# EAGLE design easyMini (EAGLE 9.6.2)
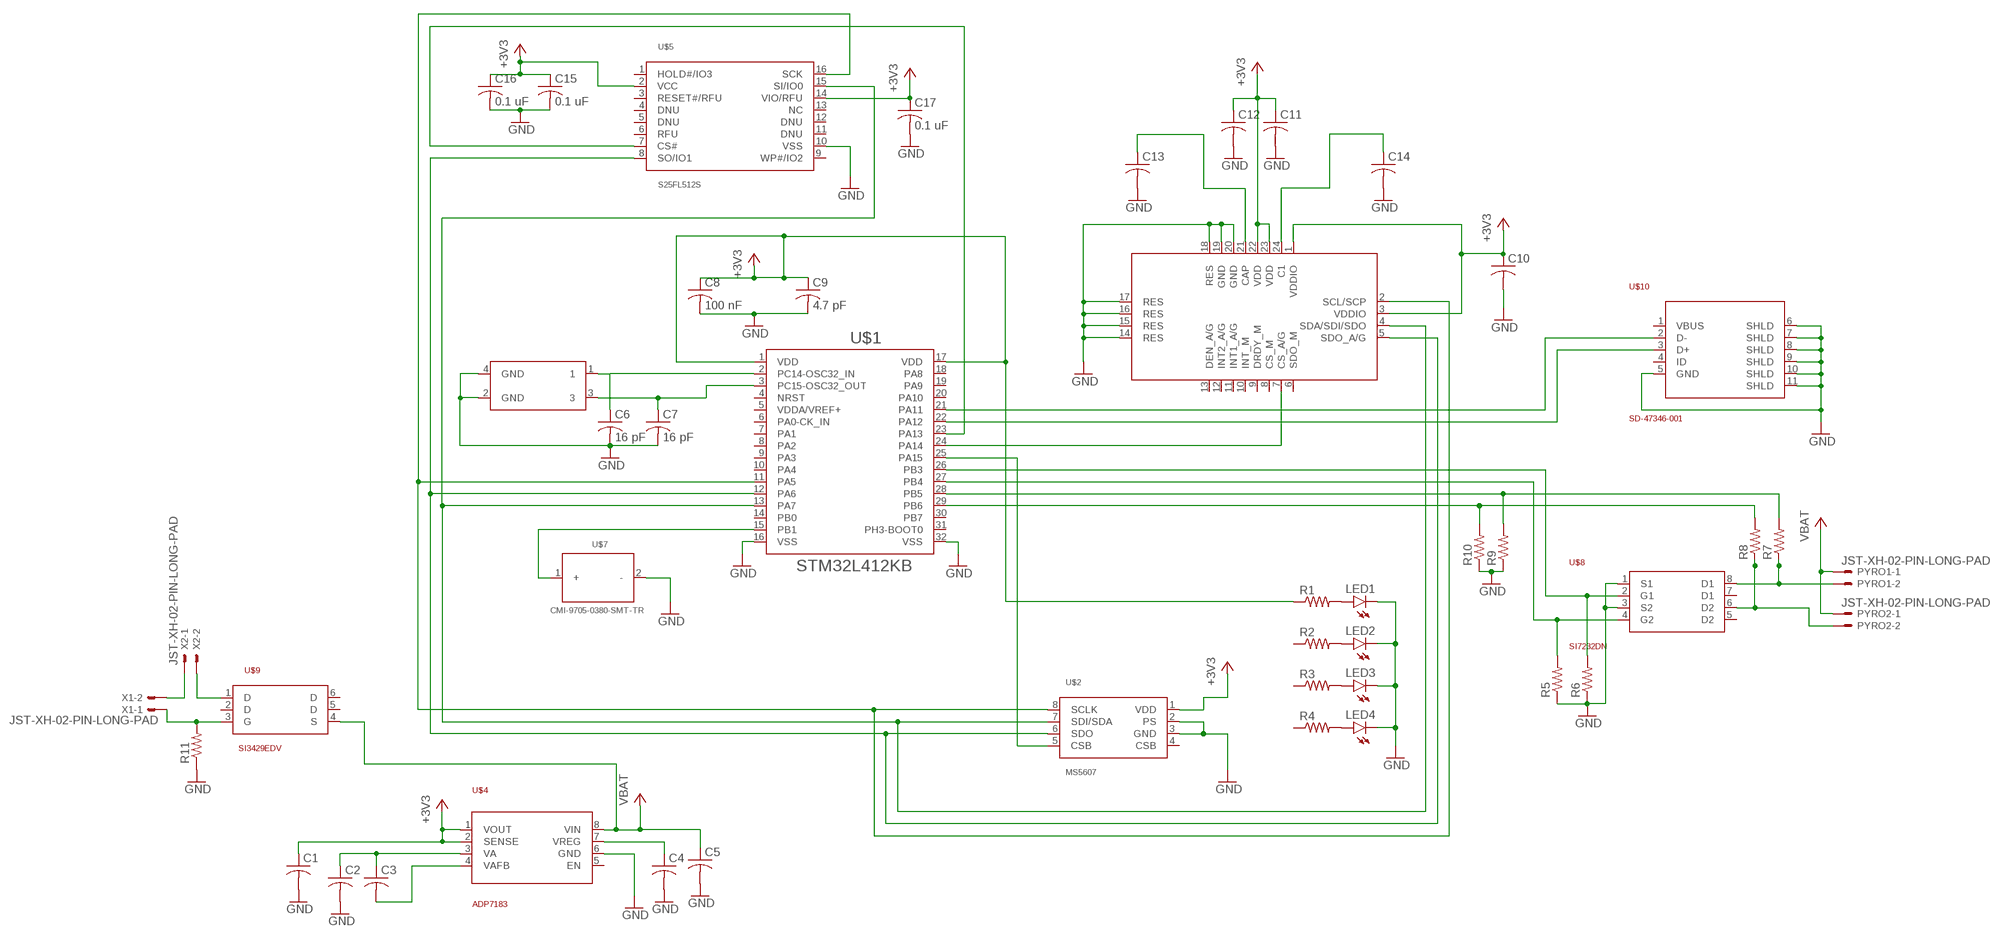
[diagram p0: schematic, sheet 1]

## Parts
C1  C-USC0805  [C0805]
C2  C-USC0805  [C0805]
C3  C-USC0805  [C0805]
C4  C-USC0805  [C0805]
C5  C-USC0805  [C0805]
C6  16 pF  C-USC0805  [C0805]
C7  16 pF  C-USC0805  [C0805]
C8  100 nF  C-USC0805  [C0805]
C9  4.7 pF  C-USC0805  [C0805]
C10  C-USC0805  [C0805]
C11  C-USC0805  [C0805]
C12  C-USC0805  [C0805]
C13  C-USC0805  [C0805]
C14  C-USC0805  [C0805]
C15  0.1 uF  C-USC0805  [C0805]
C16  0.1 uF  C-USC0805  [C0805]
C17  0.1 uF  C-USC0805  [C0805]
LED1  LED  [SMARTLED-TTW]
LED2  LED  [SMARTLED-TTW]
LED3  LED  [SMARTLED-TTW]
LED4  LED  [SMARTLED-TTW]
PYRO1  JST-XH-02-PIN-LONG-PAD  [JST-XH-02-PACKAGE-LONG-PAD]
PYRO2  JST-XH-02-PIN-LONG-PAD  [JST-XH-02-PACKAGE-LONG-PAD]
R1  R-US_M0805  [M0805]
R2  R-US_M0805  [M0805]
R3  R-US_M0805  [M0805]
R4  R-US_M0805  [M0805]
R5  R-US_M0805  [M0805]
R6  R-US_M0805  [M0805]
R7  R-US_M0805  [M0805]
R8  R-US_M0805  [M0805]
R9  R-US_M0805  [M0805]
R10  R-US_M0805  [M0805]
R11  R-US_M0805  [M0805]
U$1  STM32L412KB  [LQFP32]
U$2  MS5607  [MS5607]
U$3  LSM9DS1  [LSM9DS1]
U$4  ADP7183  [ADP7183]
U$5  S25FL512S  [S25FL512S]
U$6  SXT1148FE48-24.000MT  [SXT114]
U$7  CMI-9705-0380-SMT-TR  [CMI-9705-0380-SMT-TR]
U$8  SI7232DN  [SI7232DN]
U$9  SI3429EDV  [SI3429EDV]
U$10  SD-47346-001  [SD-47346-001]
X1  JST-XH-02-PIN-LONG-PAD  [JST-XH-02-PACKAGE-LONG-PAD]
X2  JST-XH-02-PIN-LONG-PAD  [JST-XH-02-PACKAGE-LONG-PAD]

## Nets
+3V3: C1.1 C8.1 C9.1 C10.1 C11.1 C12.1 C15.1 C16.1 C17.1 PYRO1.1 PYRO2.1 R1.1 U$1.1(VDD) U$1.17(VDD) U$2.1(VDD) U$3.1(VDDIO) U$3.3(VDDIO) U$3.22(VDD) U$3.23(VDD) U$4.1(VOUT) U$4.2(SENSE) U$5.2(VCC) U$5.14(VIO/RFU) ; supply symbol labelled VBAT
GND: C1.2 C2.2 C4.2 C5.2 C6.2 C7.2 C8.2 C9.2 C10.2 C11.2 C12.2 C13.2 C14.2 C15.2 C16.2 C17.2 LED1.C@1(C) LED2.C@1(C) LED3.C@1(C) LED4.C@1(C) R5.1 R6.1 R9.1 R10.1 R11.1 U$1.16(VSS) U$1.32(VSS) U$2.2(PS) U$2.3(GND) U$3.14(RES) U$3.15(RES) U$3.16(RES) U$3.17(RES) U$3.18(RES) U$3.19(GND) U$3.20(GND) U$4.6(GND) U$5.10(VSS) U$6.2(GND) U$6.4(GND) U$7.2(-) U$8.1(S1) U$8.3(S2) U$10.5(GND) U$10.6(SHLD) U$10.7(SHLD) U$10.8(SHLD) U$10.9(SHLD) U$10.10(SHLD) U$10.11(SHLD)
N$1: U$1.13(PA7) U$2.7(SDI/SDA) U$3.4(SDA/SDI/SDO) U$5.15(SI/IO0)
N$2: U$1.11(PA5) U$2.8(SCLK) U$3.2(SCL/SCP) U$5.16(SCK)
N$3: U$1.12(PA6) U$2.6(SDO) U$3.5(SDO_A/G) U$5.8(SO/IO1)
N$4: C13.1 U$3.21(CAP)
N$5: C14.1 U$3.24(C1)
N$6: C2.1 C3.1 U$4.3(VA)
N$7: C4.1 U$4.7(VREG)
N$8: C3.2 U$4.4(VAFB)
N$9: U$1.23(PA13) U$5.7(CS#)
N$10: LED1.A@1(A) R1.2
N$11: LED2.A@1(A) R2.2
N$12: LED3.A@1(A) R3.2
N$13: LED4.A@1(A) R4.2
N$14: PYRO1.2 R7.1 U$8.8(D1)
N$15: U$1.24(PA14) U$3.7(CS_A/G)
N$16: U$1.25(PA15) U$2.5(CSB)
N$17: PYRO2.2 R8.1 U$8.6(D2)
N$18: R6.2 U$1.26(PB3) U$8.2(G1)
N$19: R5.2 U$1.27(PB4) U$8.4(G2)
N$20: U$1.15(PB1) U$7.1(+)
N$21: R7.2 R9.2 U$1.28(PB5)
N$22: R8.2 R10.2 U$1.29(PB6)
N$23: X1.2 X2.1
N$24: C6.1 U$1.2(PC14-OSC32_IN) U$6.1
N$25: C7.1 U$1.3(PC15-OSC32_OUT) U$6.3
N$26: R11.2 U$9.3(G) X1.1
N$27: U$9.1(D) X2.2
N$28: U$1.21(PA11) U$10.2(D-)
N$29: U$1.22(PA12) U$10.3(D+)
VCC: C5.1 U$4.8(VIN) U$9.4(S) ; supply symbol labelled VBAT
Unconnected: R2.1 R3.1 R4.1 U$1.4(NRST) U$1.5(VDDA/VREF+) U$1.6(PA0-CK_IN) U$1.7(PA1) U$1.8(PA2) U$1.9(PA3) U$1.10(PA4) U$1.14(PB0) U$1.18(PA8) U$1.19(PA9) U$1.20(PA10) U$1.30(PB7) U$1.31(PH3-BOOT0) U$2.4(CSB) U$3.6(SDO_M) U$3.8(CS_M) U$3.9(DRDY_M) U$3.10(INT_M) U$3.11(INT1_A/G) U$3.12(INT2_A/G) U$3.13(DEN_A/G) U$4.5(EN) U$5.1(HOLD#/IO3) U$5.3(RESET#/RFU) U$5.4(DNU) U$5.5(DNU) U$5.6(RFU) U$5.9(WP#/IO2) U$5.11(DNU) U$5.12(DNU) U$5.13(NC) U$8.5(D2) U$8.7(D1) U$9.2(D) U$9.5(D) U$9.6(D) U$10.1(VBUS) U$10.4(ID)

## Library data of the parts
C1-C17 = rcl:C-US: CAPACITOR, American symbol; SPICEPREFIX: C
LED1-LED4 = led:LED: LED OSRAM: - CHIPLED LG R971, LG N971, LY N971, LG Q971, LY Q971, LO R971, LY R971 LH N974, LH R974 LS Q976, LO Q976, LY Q976 LO Q996 - Hyper CHIPLED LW Q18S LB Q993, LB Q99A, LB R99A - SideLED LS A670, LO A670, LY A670, LG A670, LP A670 LB A673, LV A673, LT A673, LW A673 LH A674 LY A675 LS A676, LA A676, LO A676, LY A676, LW A676 LS A679, LY A679, LG A679 - Hyper Micro SIDELED® LS Y876, LA Y876, LO Y876, LY Y876 LT Y87S - SmartLED LW L88C, LW L88S LB L89C, LB L89S, LG L890 LS L89K, LO L89K, LY L89K LS L896, LA L896, LO L896, LY L896 - TOPLED LS T670, LO T670, LY T670, LG T670, LP T670 LSG T670, LSP T670, LSY T670, LOP T670, LYG T670 LG T671, LOG T671, LSG T671 LB T673, LV T673, LT T673, LW T673 LH T674 LS T676, LA T676, LO T676, LY T676, LB T676, LH T676, LSB T676, LW T676 LB T67C, LV T67C, LT T67C, LS T67K, LO T67K, LY T67K, LW E67C LS E67B, LA E67B, LO E67B, LY E67B, LB E67C, LV E67C, LT E67C LW T67C LS T679, LY T679, LG T679 LS T770, LO T770, LY T770, LG T770, LP T770 LB T773, LV T773, LT T773, LW T773 LH T774 LS E675, LA E675, LY E675, LS T675 LS T776, LA T776, LO T776, LY T776, LB T776 LHGB T686 LT T68C, LB T68C - Hyper Mini TOPLED® LB M676 - Mini TOPLED Santana® LG M470 LS M47K, LO M47K, LY M47K Source: http://www.osram.convergy.de LUXEON: - LUMILED® LXK2-PW12-R00, LXK2-PW12-S00, LXK2-PW14-U00, LXK2-PW14-V00 LXK2-PM12-R00, LXK2-PM12-S00, LXK2-PM14-U00 LXK2-PE12-Q00, LXK2-PE12-R00, LXK2-PE12-S00, LXK2-PE14-T00, LXK2-PE14-U00 LXK2-PB12-K00, LXK2-PB12-L00, LXK2-PB12-M00, LXK2-PB14-N00, LXK2-PB14-P00, LXK2-PB14-Q00 LXK2-PR12-L00, LXK2-PR12-M00, LXK2-PR14-Q00, LXK2-PR14-R00 LXK2-PD12-Q00, LXK2-PD12-R00, LXK2-PD12-S00 LXK2-PH12-R00, LXK2-PH12-S00 LXK2-PL12-P00, LXK2-PL12-Q00, LXK2-PL12-R00 Source: www.luxeon.com KINGBRIGHT: KA-3528ASYC Source: www.kingbright.com
PYRO1 PYRO2 X1 X2 = Rembrandt Electronics - JST XH Connectors v1-0:JST-XH-02-PIN: JST XH Connector 2 Pin Wire to board connector. Pitch: 2,54 mm, (0.100") Number of pins: 2 Created by Rembrandt Electronics www.rembrandtelectronics.com
R1-R11 = rcl:R-US_: RESISTOR, American symbol; SPICEPREFIX: R
U$1 = stm32lib:STM32L412KB
U$2 = generalUse:MS5607
U$3 = generalUse:LSM9DS1
U$4 = generalUse:ADP7183
U$5 = generalUse:S25FL512S
U$6 = generalUse:SXT1148FE48-24.000MT
U$7 = generalUse:CMI-9705-0380-SMT-TR
U$8 = generalUse:SI7232DN
U$9 = generalUse:SI3429EDV
U$10 = generalUse:SD-47346-001

## Board
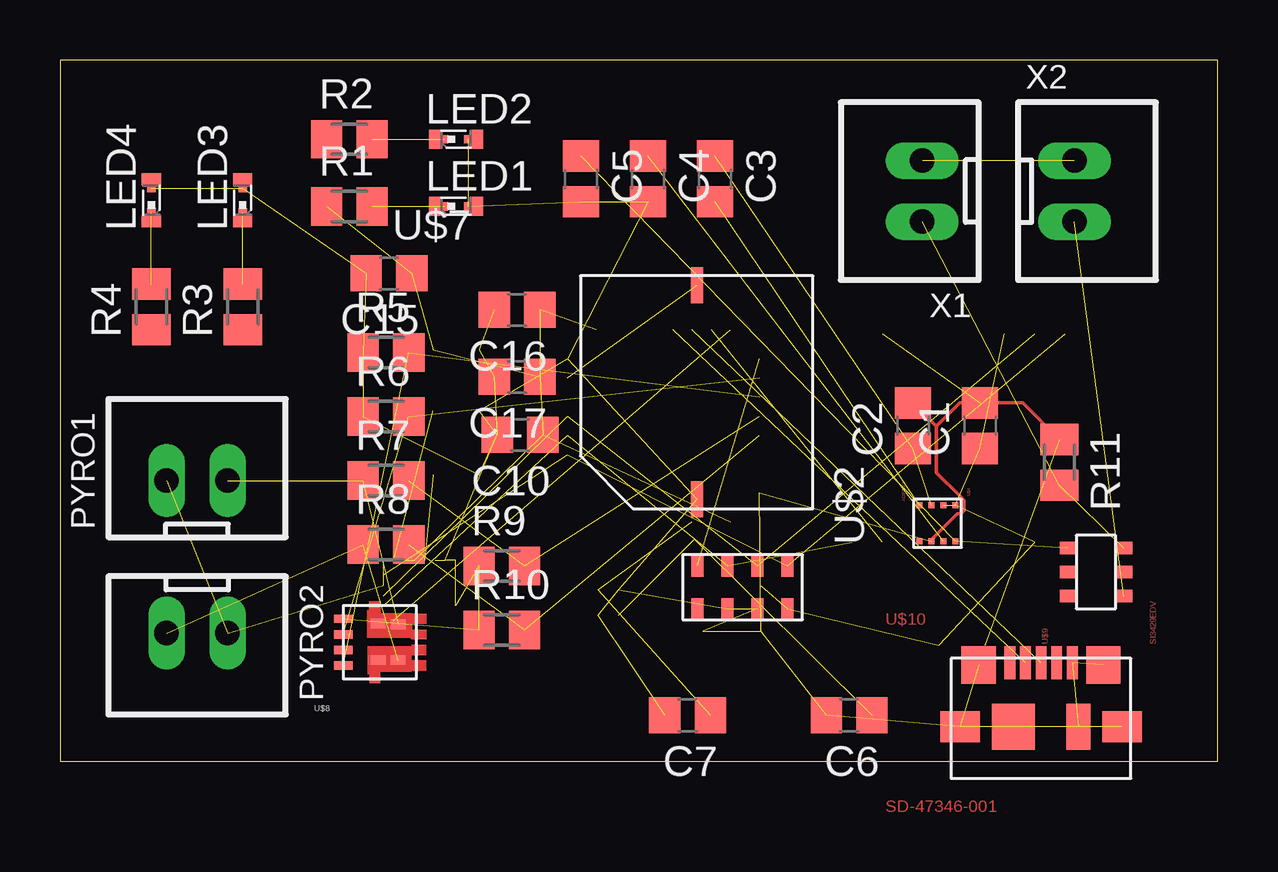
[diagram p1: board, top side]
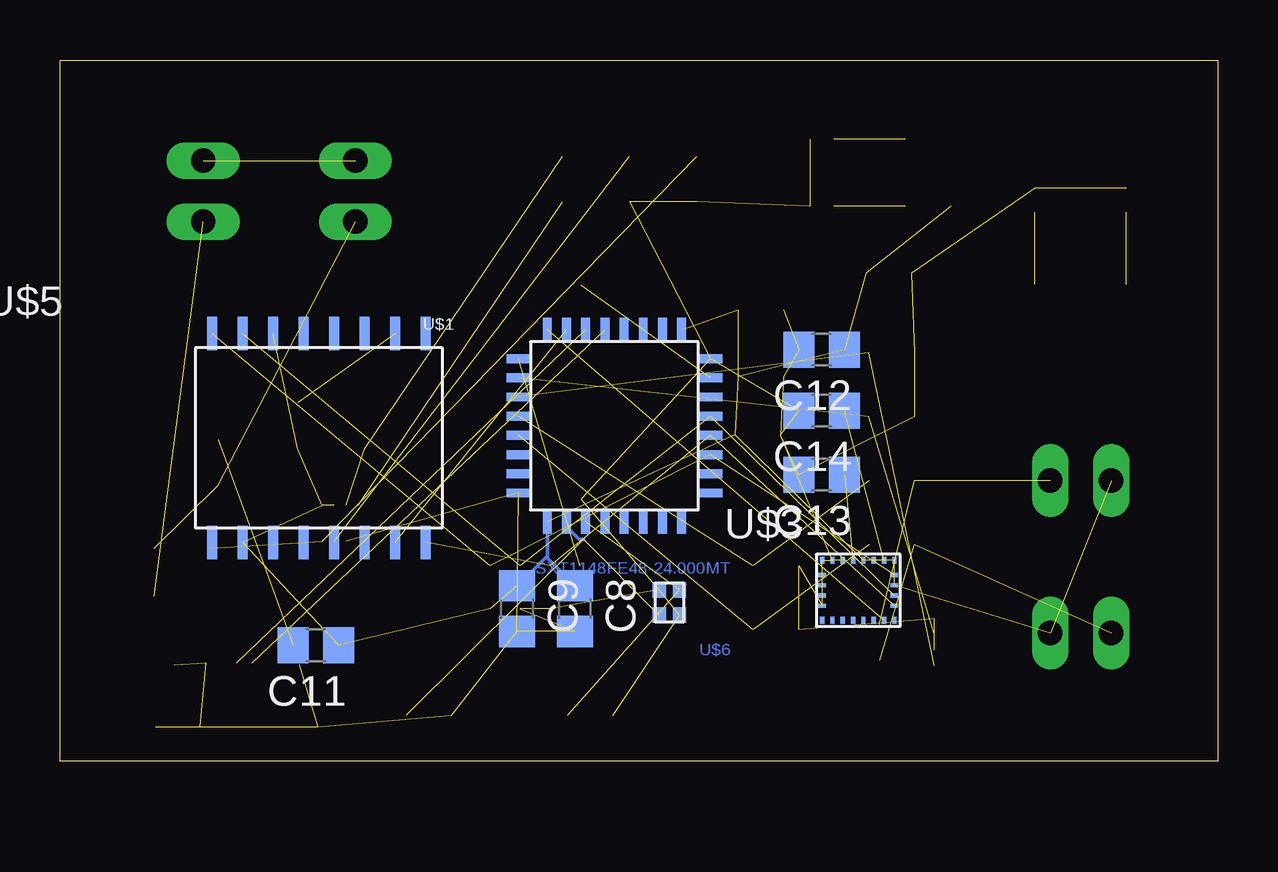
[diagram p2: board, bottom side, seen from below]

Size 48.26 x 29.21 mm. Coordinates in mm from the lower left corner, seen from the top.
Outline: 0,0 48.26,0 48.26,29.21 0,29.21 0,0
Copper layers (1*16): Top 0.035mm / dielectric 1.5mm / Bottom 0.035mm
Design rules "default": minimum track width 6mil, minimum drill 0.35mm, track to track 6mil, track to pad 6mil, pad to pad 6mil, via to via 6mil, smd to smd 6mil, copper to edge 40mil, drill to drill 6mil, minimum pad ring 10mil, minimum via ring 8mil, stop-mask expansion 4mil, vias tented up to drill 0mil, thermal gap 10mil

### Footprints (pad centres in the part's own frame; a part is rotated, then mirrored left to right if it is on the bottom)
C0805 = smd 1.3 x 1.5: 1 -0.95,0; 2 0.95,0
SMARTLED-TTW = smd 0.8 x 0.5: A 0,-0.875; C 0,0.875 | smd 0.35 x 0.35: A@1 0,-0.5; C@1 0,0.5
JST-XH-02-PACKAGE-LONG-PAD = drill 1.016 long: 1 -1.27,0; 2 1.27,0
M0805 = smd 1.3 x 1.6: 1 -0.95,0; 2 0.95,0
LQFP32 = smd 0.37 x 1: 1 -2.8,-4; 2 -2,-4; 3 -1.2,-4; 4 -0.4,-4; 5 0.4,-4; 6 1.2,-4; 7 2,-4; 8 2.8,-4; 17 2.8,4; 18 2,4; 19 1.2,4; 20 0.4,4; 21 -0.4,4; 22 -1.2,4; 23 -2,4; 24 -2.8,4 | smd 1 x 0.37: 9 4,-2.8; 10 4,-2; 11 4,-1.2; 12 4,-0.4; 13 4,0.4; 14 4,1.2; 15 4,2; 16 4,2.8; 25 -4,2.8; 26 -4,2; 27 -4,1.2; 28 -4,0.4; 29 -4,-0.4; 30 -4,-1.2; 31 -4,-2; 32 -4,-2.8
MS5607 = smd 0.9 x 0.5: 1 0.9,1.875; 2 0.9,0.625; 3 0.9,-0.625; 4 0.9,-1.875; 5 -0.9,-1.875; 6 -0.9,-0.625; 7 -0.9,0.625; 8 -0.9,1.875
LSM9DS1 = smd 0.18 x 0.3: 1 1.505,1.25; 6 1.505,-1.25; 7 1.075,-1.25; 8 0.645,-1.25; 9 0.215,-1.25; 10 -0.215,-1.25; 11 -0.645,-1.25; 12 -1.075,-1.25; 13 -1.505,-1.25; 18 -1.505,1.25; 19 -1.075,1.25; 20 -0.645,1.25; 21 -0.215,1.25; 22 0.215,1.25; 23 0.645,1.25; 24 1.075,1.25 | smd 0.3 x 0.18: 2 1.5,0.645; 3 1.5,0.215; 4 1.5,-0.215; 5 1.5,-0.645; 14 -1.5,-0.645; 15 -1.5,-0.215; 16 -1.5,0.215; 17 -1.5,0.645
ADP7183 = smd 0.25 x 0.25: 1 -0.75,0.75; 2 -0.75,0.25; 3 -0.75,-0.25; 4 -0.75,-0.75; 5 0.75,-0.75; 6 0.75,-0.25; 7 0.75,0.25; 8 0.75,0.75
S25FL512S = smd 0.41 x 1.4: 1 -4.445,-4.35; 2 -3.175,-4.35; 3 -1.905,-4.35; 4 -0.635,-4.35; 5 0.635,-4.35; 6 1.905,-4.35; 7 3.175,-4.35; 8 4.445,-4.35; 9 4.445,4.35; 10 3.175,4.35; 11 1.905,4.35; 12 0.635,4.35; 13 -0.635,4.35; 14 -1.905,4.35; 15 -3.175,4.35; 16 -4.445,4.35
SXT114 = smd 0.55 x 0.65: 1 0.425,0.525; 2 0.425,-0.525; 3 -0.425,-0.525; 4 -0.425,0.525
CMI-9705-0380-SMT-TR = smd 0.5 x 1.5: 1 0,4.45; 2 0,-4.45
SI7232DN = smd 0.76 x 0.35: 1 -1.525,0.975; 2 -1.525,0.325; 3 -1.525,-0.325; 4 -1.525,-0.975 | smd 0.6 x 0.4: 5 -0.061,-0.746; 6 0.752,-0.746; 7 -0.086,0.772; 8 0.777,0.746
SI3429EDV = smd 0.508 x 0.699: 1 -1.001,-1.162; 2 0,-1.162; 3 1.001,-1.162; 4 1.001,1.163; 5 0,1.163; 6 -1.001,1.163
SD-47346-001 = smd 0.45 x 1.38: 1 -1.3,2.31; 2 -0.65,2.31; 3 0,2.31; 4 0.65,2.31; 5 1.3,2.31 | smd 1.425 x 1.55: 6 -2.6,2.225; 11 2.6,2.225 | smd 1.65 x 1.3: 7 -3.375,-0.35; 10 3.375,-0.35 | smd 1.8 x 1.9: 8 -1.15,-0.35 | smd 1 x 1.9: 9 1.55,-0.35

### Placement (x,y rotation side)
C1  38.35,13.97 90 top
C2  35.56,13.97 90 top
C3  27.3,24.26 270 top
C4  24.51,24.26 270 top
C5  21.72,24.26 270 top
C6  32.89,1.91 180 top
C7  26.16,1.91 180 top
C8  26.8,6.35 270 bottom
C9  29.21,6.35 270 bottom
C10  19.18,13.59 180 top
C11  37.59,4.83 180 bottom
C12  16.51,17.14 180 bottom
C13  16.51,11.94 180 bottom
C14  16.51,14.61 180 bottom
C15  13.72,20.32 180 top
C16  19.05,18.8 180 top
C17  19.05,16 180 top
LED1  16.51,23.11 270 top
LED2  16.51,25.91 270 top
LED3  7.62,23.37 0 top
LED4  3.81,23.37 0 top
PYRO1  5.71,11.68 0 top
PYRO2  5.71,5.33 180 top
R1  12.06,23.11 0 top
R2  12.06,25.91 0 top
R3  7.62,18.92 90 top
R4  3.81,18.92 90 top
R5  13.59,17.02 0 top
R6  13.59,14.35 0 top
R7  13.59,11.68 0 top
R8  13.59,9.02 0 top
R9  18.41,8.13 0 top
R10  18.41,5.46 0 top
R11  41.66,12.45 270 top
U$1  25.15,13.97 0 bottom
U$2  28.45,7.24 270 top
U$3  14.99,7.11 0 bottom
U$4  36.58,9.91 270 top
U$5  37.47,13.46 0 bottom
U$6  22.86,6.6 180 bottom
U$7  26.54,15.37 0 top
U$8  13.34,4.95 0 top
U$9  43.18,7.87 90 top
U$10  40.89,1.78 0 top
X1  35.94,23.75 90 top
X2  42.29,23.75 270 top

### Tracks (layer width: path | path; a pad name or v marks a point on that pad's centre or on a via)
+3V3  (20 unrouted)
  Bottom 0.152: C9.1 27.95,8.56 | 27.95,8.56 U$1.1 | C8.1 27.95,8.45 27.95,8.56
GND  (46 unrouted)
  Top 0.152: R11.1 40.13,14.92 C1.2 37.52,14.92 36.54,13.94 | U$4.6 36.33,9.23 37.4,10.3 37.55,10.3 37.68,10.44 37.68,10.88 37.55,11.01 37.54,11.01 36.54,12.01 36.54,13.94 | 36.54,13.94 C2.2
N$1  (3 unrouted)
N$2  (3 unrouted)
N$3  (3 unrouted)
N$4  (1 unrouted)
N$5  (1 unrouted)
N$6  (2 unrouted)
N$7  (1 unrouted)
N$8  (1 unrouted)
N$9  (1 unrouted)
N$10  (1 unrouted)
N$11  (1 unrouted)
N$12  (1 unrouted)
N$13  (1 unrouted)
N$14  (2 unrouted)
N$15  (1 unrouted)
N$16  (1 unrouted)
N$17  (2 unrouted)
N$18  (2 unrouted)
N$19  (2 unrouted)
N$20  (1 unrouted)
N$21  (2 unrouted)
N$22  (2 unrouted)
N$23  (1 unrouted)
N$24  (2 unrouted)
  Bottom 0.152: 26.45,9.24 26.63,9.24 27.15,9.76 U$1.2
N$25  (2 unrouted)
  Bottom 0.152: U$6.3 22.21,7.36
N$26  (2 unrouted)
N$27  (1 unrouted)
N$28  (1 unrouted)
N$29  (1 unrouted)
VCC  (2 unrouted)